# EAGLE design USB_Hub (EAGLE 9.6.2)
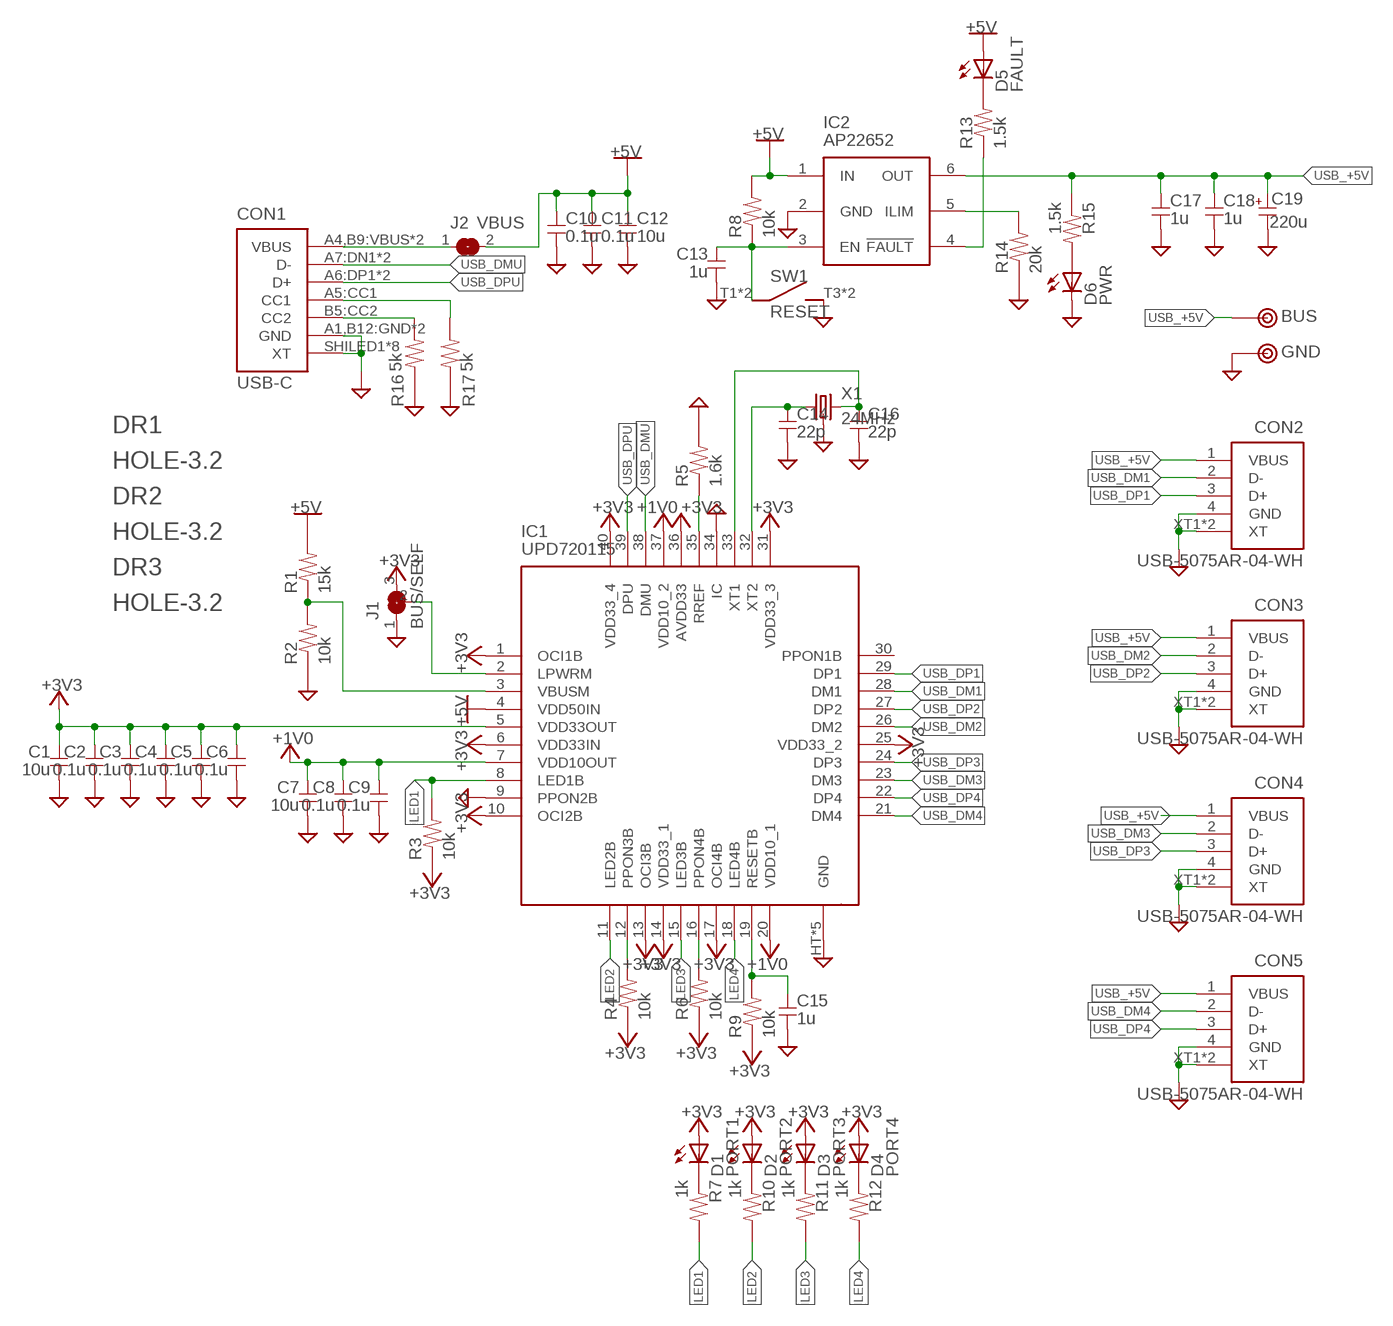
[diagram p0: schematic, sheet 1]

## Parts
C1  10u  C-1608  [1608]
C2  0.1u  C-1608  [1608]
C3  0.1u  C-1608  [1608]
C4  0.1u  C-1608  [1608]
C5  0.1u  C-1608  [1608]
C6  0.1u  C-1608  [1608]
C7  10u  C-1608  [1608]
C8  0.1u  C-1608  [1608]
C9  0.1u  C-1608  [1608]
C10  0.1u  C-1608  [1608]
C11  0.1u  C-1608  [1608]
C12  10u  C-2012  [2012]
C13  1u  C-1608  [1608]
C14  22p  C-1608  [1608]
C15  1u  C-1608  [1608]
C16  22p  C-1608  [1608]
C17  1u  C-1608  [1608]
C18  1u  C-1608  [1608]
C19  220u  CPOLE2.5-6.5  [E2.5-6.5]
CON1  USB-C  [5077CR-16-SMC2-BK-TR]
CON2  USB-5075AR-04-WH  [5075AR-04-WH]
CON3  USB-5075AR-04-WH  [5075AR-04-WH]
CON4  USB-5075AR-04-WH  [5075AR-04-WH]
CON5  USB-5075AR-04-WH  [5075AR-04-WH]
D1  PORT1  LED-2.5  [LED2.5]
D2  PORT2  LED-2.5  [LED2.5]
D3  PORT3  LED-2.5  [LED2.5]
D4  PORT4  LED-2.5  [LED2.5]
D5  FAULT  LED-SMD1608  [D1608]
D6  PWR  LED-SMD1608  [D1608]
DR1  HOLE-3.2  [HOLE_3.2]
DR2  HOLE-3.2  [HOLE_3.2]
DR3  HOLE-3.2  [HOLE_3.2]
IC1  UPD720115  [QFN40HT]
IC2  AP22652  [SOT23-6]
J1  BUS/SELF  SJ-3-1608  [1608-3-J]
J2  VBUS  SJ-1608  [1608-J]
R1  15k  R-1608  [1608]
R2  10k  R-1608  [1608]
R3  10k  R-1608  [1608]
R4  10k  R-1608  [1608]
R5  1.6k  R-1608  [1608]
R6  10k  R-1608  [1608]
R7  1k  R-1608  [1608]
R8  10k  R-1608  [1608]
R9  10k  R-1608  [1608]
R10  1k  R-1608  [1608]
R11  1k  R-1608  [1608]
R12  1k  R-1608  [1608]
R13  1.5k  R-1608  [1608]
R14  20k  R-1608  [1608]
R15  1.5k  R-1608  [1608]
R16  5k  R-1608  [1608]
R17  5k  R-1608  [1608]
SW1  RESET  SW  [SW_PUSH]
TP1  BUS  TESTPIN  [TESTPIN]
TP2  GND  TESTPIN  [TESTPIN]
X1  24MHz  CRYSTAL2  [KC3225]

## Nets
+1V0 [Power]: C7.1 C8.1 C9.1 IC1.7(VDD10OUT) IC1.20(VDD10_1) IC1.37(VDD10_2)
+3V3 [Power]: C1.1 C2.1 C3.1 C4.1 C5.1 C6.1 D1.A D2.A D3.A D4.A IC1.1(OCI1B) IC1.5(VDD33OUT) IC1.6(VDD33IN) IC1.10(OCI2B) IC1.13(OCI3B) IC1.14(VDD33_1) IC1.17(OCI4B) IC1.25(VDD33_2) IC1.31(VDD33_3) IC1.36(AVDD33) IC1.40(VDD33_4) J1.3 R3.1 R4.1 R6.1 R9.1
+5V: C10.1 C11.1 C12.1 D5.A IC1.4(VDD50IN) IC2.1(IN) J2.2 R1.2 R8.2
GND: C1.2 C2.2 C3.2 C4.2 C5.2 C6.2 C7.2 C8.2 C9.2 C10.2 C11.2 C12.2 C13.2 C14.2 C15.2 C16.2 C17.2 C18.2 C19.- CON1.A1,B12:GND(GND) CON1.B1,A12:GND(GND) CON1.SHILED1(XT) CON1.SHILED2(XT) CON1.SHILED3(XT) CON1.SHILED4(XT) CON1.SHILED5(XT) CON1.SHILED6(XT) CON1.SHILED7(XT) CON1.SHILED8(XT) CON2.4(GND) CON2.XT1(XT) CON2.XT2(XT) CON3.4(GND) CON3.XT1(XT) CON3.XT2(XT) CON4.4(GND) CON4.XT1(XT) CON4.XT2(XT) CON5.4(GND) CON5.XT1(XT) CON5.XT2(XT) D6.K IC1.9(PPON2B) IC1.34(IC) IC1.HT1(GND) IC1.HT2(GND) IC1.HT3(GND) IC1.HT4(GND) IC1.HT(GND) IC2.2(GND) J1.1 R2.1 R5.2 R14.1 R16.1 R17.1 SW1.T3 SW1.T4 TP2.1 X1.2(GND) X1.4(GND)
LED1: IC1.8(LED1B) R3.2 R7.2
LED2: IC1.11(LED2B) R10.2
LED3: IC1.15(LED3B) R11.2
LED4: IC1.18(LED4B) R12.2
N$1: CON1.A4,B9:VBUS(VBUS) CON1.B4,A9:VBUS(VBUS) J2.1
N$2: D5.K R13.2
N$3: IC1.3(VBUSM) R1.1 R2.2
N$4: IC1.35(RREF) R5.1
N$5: C14.1 IC1.32(XT2) X1.1
N$6: C16.1 IC1.33(XT1) X1.3
N$7: C15.1 IC1.19(RESETB) R9.2
N$8: D1.K R7.1
N$9: D2.K R10.1
N$10: D3.K R11.1
N$11: D4.K R12.1
N$12: IC2.4(!FAULT) R13.1
N$13: IC2.5(ILIM) R14.2
N$14: IC1.16(PPON4B) R6.2
N$15: IC1.12(PPON3B) R4.2
N$16: D6.A R15.2
N$17: IC1.2(LPWRM) J1.2
N$18: CON1.B5:CC2(CC2) R16.2
N$19: CON1.A5:CC1(CC1) R17.2
USB_+5V: C17.1 C18.1 C19.+ CON2.1(VBUS) CON3.1(VBUS) CON4.1(VBUS) CON5.1(VBUS) IC2.6(OUT) R15.1 TP1.1
USB_DM1: CON2.2(D-) IC1.28(DM1)
USB_DM2: CON3.2(D-) IC1.26(DM2)
USB_DM3: CON4.2(D-) IC1.23(DM3)
USB_DM4: CON5.2(D-) IC1.21(DM4)
USB_DMU: CON1.A7:DN1(D-) CON1.B7:DN2(D-) IC1.38(DMU)
USB_DP1: CON2.3(D+) IC1.29(DP1)
USB_DP2: CON3.3(D+) IC1.27(DP2)
USB_DP3: CON4.3(D+) IC1.24(DP3)
USB_DP4: CON5.3(D+) IC1.22(DP4)
USB_DPU: CON1.A6:DP1(D+) CON1.B6:DP2(D+) IC1.39(DPU)
VBUS_EN: C13.1 IC2.3(EN) R8.1 SW1.T1 SW1.T2
Unconnected: IC1.30(PPON1B)

## Library data of the parts
C1-C18 = my_rcl:C
C19 = my_rcl:CPOL
CON1 = my_connector:USB-C
CON2-CON5 = my_connector:USB
D1-D6 = my_rcl:LED
DR1-DR3 = my_connector:HOLE-3.2
IC1 = my_ic:UPD720115
IC2 = my_ic:AP22652
J1 = my_rcl:SJ-3
J2 = my_rcl:SJ
R1-R17 = my_rcl:R
SW1 = my_rcl:SW
TP1 TP2 = my_connector:TESTPIN
X1 = my_rcl:CRYSTAL2: CRYSTAL

## Net classes
1 Power: width 0.254 mm

## Board
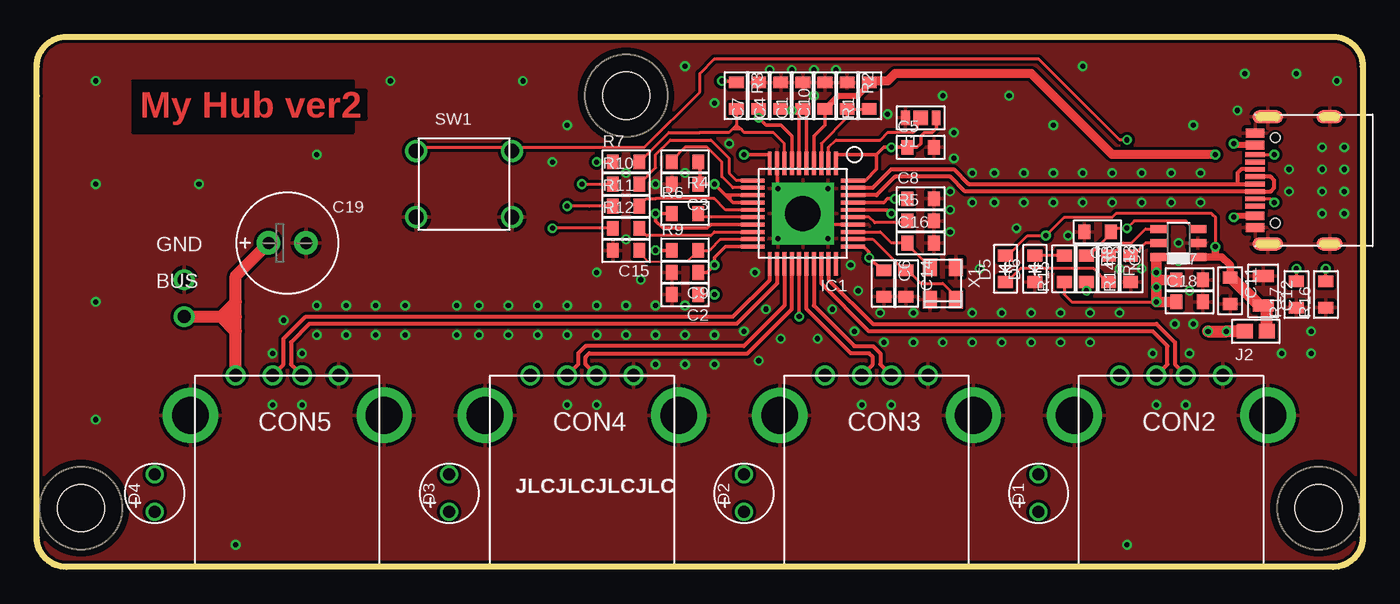
[diagram p1: board, top side]
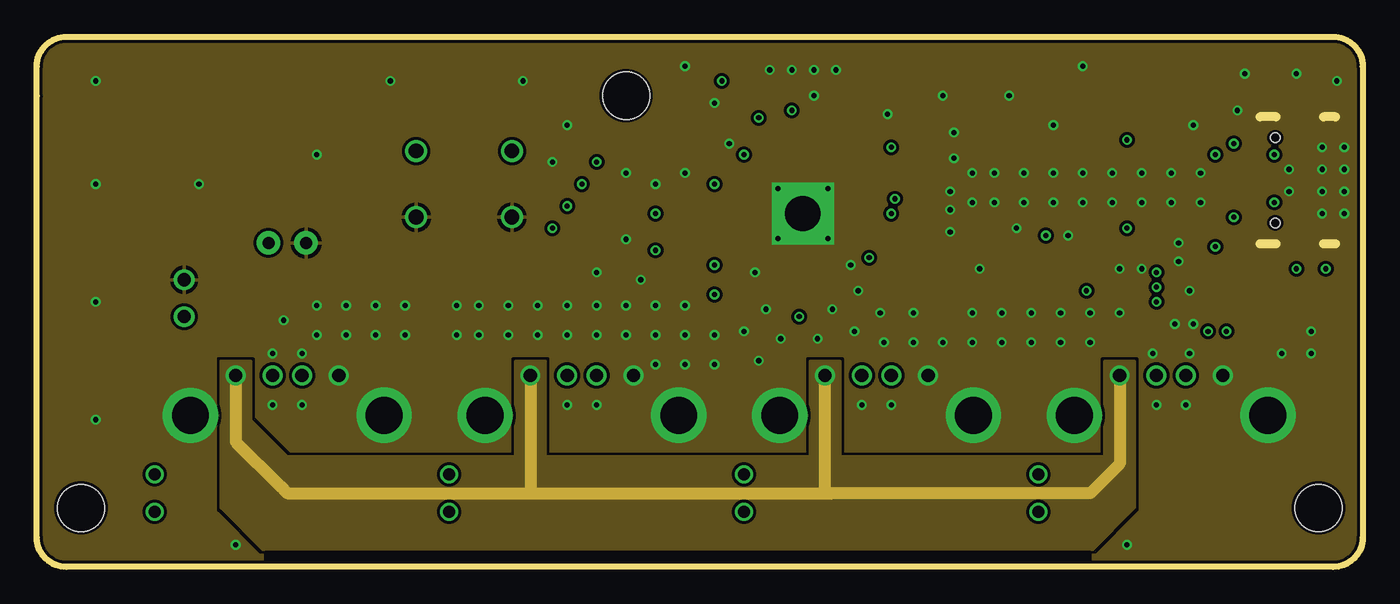
[diagram p2: board, inner layer Route2]
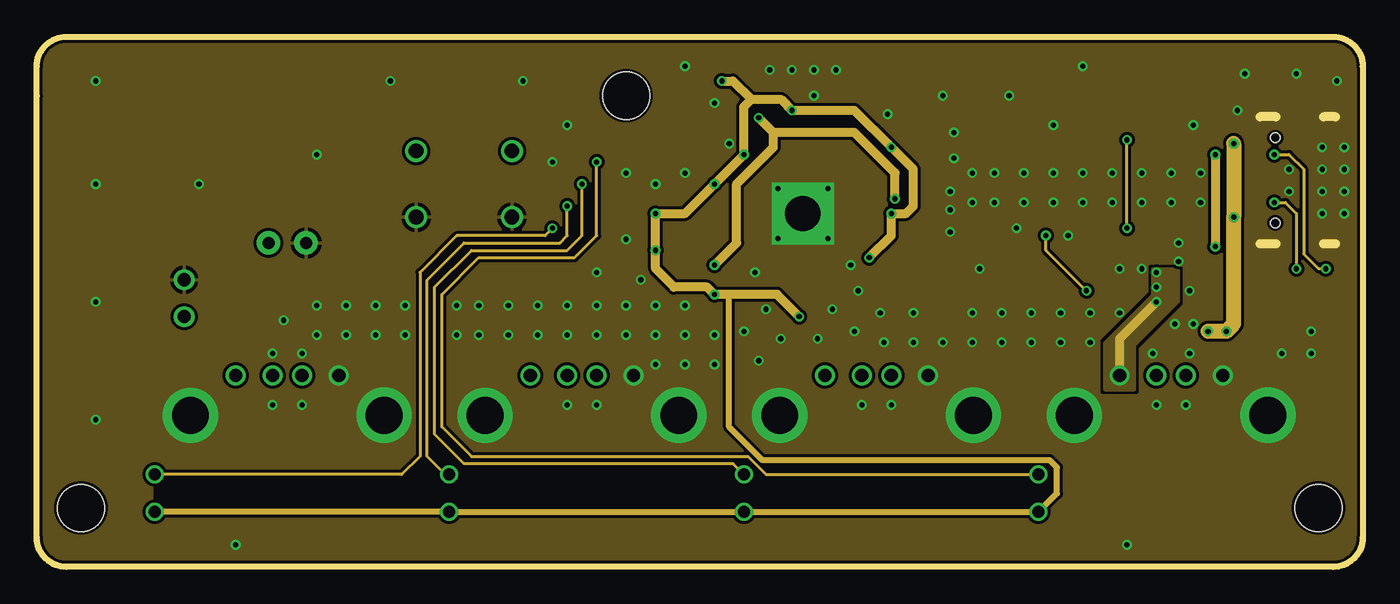
[diagram p3: board, inner layer Route15]
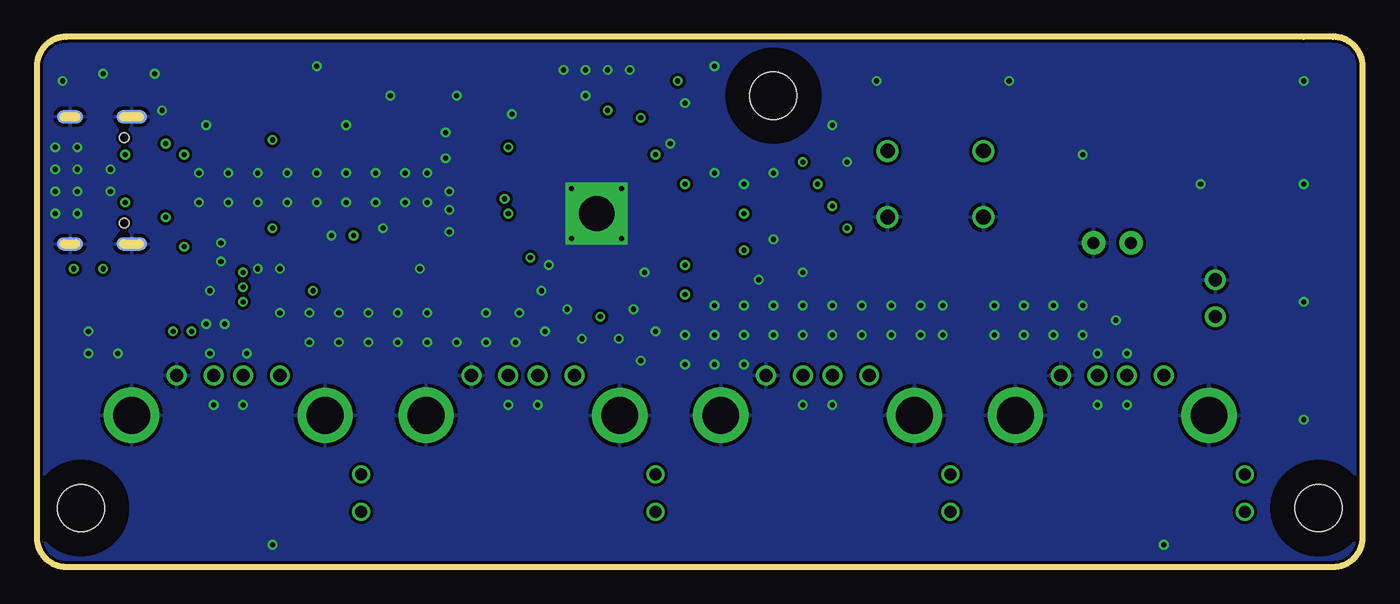
[diagram p4: board, bottom side, seen from below]

Size 90 x 36 mm. Coordinates in mm from the lower left corner, seen from the top.
Outline: 0,2 0,32 0,34 arc-90 2,36 4,36 88,36 arc-90 90,34 90,2 arc-90 88,0 2,0 arc-90 0,2
Copper layers (1*2*15*16): Top 0.035mm / dielectric 0.2mm / Route2 0.0175mm / dielectric 1.065mm / Route15 0.0175mm / dielectric 0.2mm / Bottom 0.035mm
Design rules "JLCPCB_4layer *": minimum track width 6mil, minimum drill 0.3mm, track to track 6mil, track to pad 6mil, pad to pad 6mil, via to via 8mil, smd to smd 0mil, copper to edge 0.2mm, drill to drill 0.4mm, minimum pad ring 8mil, minimum via ring 6mil, stop-mask expansion 4mil, vias tented up to drill 1mm, thermal gap 10mil
bRestrict: 2 lines

### Footprints (pad centres in the part's own frame; a part is rotated, then mirrored left to right if it is on the bottom)
1608 = smd 0.8 x 1: 1 -0.9,0; 2 0.9,0
2012 = smd 0.8 x 1.4: 1 -1,0; 2 1,0
E2.5-6.5 = drill 0.813 pad 1.6: + -1.27,0; - 1.27,0
5077CR-16-SMC2-BK-TR = smd 0.6 x 1.34: A1,B12:GND -3.2,0.3; A4,B9:VBUS -2.4,0.3; B1,A12:GND 3.2,0.3; B4,A9:VBUS 2.4,0.3 | smd 0.3 x 1.34: A5:CC1 -1.25,0.3; A6:DP1 -0.25,0.3; A7:DN1 0.25,0.3; A8:SBU1 1.25,0.3; B5:CC2 1.75,0.3; B6:DP2 0.75,0.3; B7:DN2 -0.75,0.3; B8:SBU2 -1.75,0.3 | smd 0.9 x 2.1: SHILED1 -4.32,-0.57; SHILED2 4.32,-0.57 | smd 0.9 x 1.8: SHILED3 -4.32,-4.75; SHILED4 4.32,-4.75 | smd 0.9 x 2.1 bottom: SHILED5 -4.32,-0.57; SHILED7 4.32,-0.57 | smd 0.9 x 1.8 bottom: SHILED6 -4.32,-4.75; SHILED8 4.32,-4.75 | hole 0.65: -2.89,-1.07; 2.89,-1.07
5075AR-04-WH = drill 0.9: 1 3.5,0; 2 1,0; 3 -1,0; 4 -3.5,0 | drill 2.5: XT1 -6.57,2.7; XT2 6.57,2.71
LED2.5 = drill 0.813: A -1.27,0; K 1.27,0
D1608 = smd 0.8 x 1: A 0.9,0; K -0.9,0
HOLE_3.2 = hole 3.2: 0,0
QFN40HT = smd 0.27 x 1.6: 1 -2.25,-3.4; 2 -1.75,-3.4; 3 -1.25,-3.4; 4 -0.75,-3.4; 5 -0.25,-3.4; 6 0.25,-3.4; 7 0.75,-3.4; 8 1.25,-3.4; 9 1.75,-3.4; 10 2.25,-3.4; 21 2.25,3.4; 22 1.75,3.4; 23 1.25,3.4; 24 0.75,3.4; 25 0.25,3.4; 26 -0.25,3.4; 27 -0.75,3.4; 28 -1.25,3.4; 29 -1.75,3.4; 30 -2.25,3.4 | smd 1.6 x 0.27: 11 3.4,-2.25; 12 3.4,-1.75; 13 3.4,-1.25; 14 3.4,-0.75; 15 3.4,-0.25; 16 3.4,0.25; 17 3.4,0.75; 18 3.4,1.25; 19 3.4,1.75; 20 3.4,2.25; 31 -3.4,2.25; 32 -3.4,1.75; 33 -3.4,1.25; 34 -3.4,0.75; 35 -3.4,0.25; 36 -3.4,-0.25; 37 -3.4,-0.75; 38 -3.4,-1.25; 39 -3.4,-1.75; 40 -3.4,-2.25 | drill 2.4 pad 4.2 square: HT 0,0 | drill 0.35 pad 0.8 square: HT1 -1.7,1.7; HT2 -1.7,-1.7; HT3 1.7,-1.7; HT4 1.7,1.7
SOT23-6 = smd 0.55 x 1.2: 1 -0.95,-1.3; 2 0,-1.3; 3 0.95,-1.3; 4 0.95,1.3; 5 0,1.3; 6 -0.95,1.3
1608-3-J = smd 0.6 x 1: 1 -1.05,0; 3 1.05,0 | smd 1 x 1: 2 0,0
1608-J = smd 1.1 x 1: 1 -0.75,0; 2 0.75,0
SW_PUSH = drill 1: T1 -3.25,2.25; T2 3.25,2.25; T3 -3.25,-2.25; T4 3.25,-2.25
TESTPIN = drill 0.9 pad 1.4: 1 0,0
KC3225 = smd 1.2 x 0.95: 1 -1.1,-0.875; 2 1.1,-0.875; 3 1.1,0.875; 4 -1.1,0.875

### Placement (x,y rotation side)
C1  52,32 90 top
C2  44,18.5 180 top
C3  44,26 180 top
C4  50.5,32 90 top
C5  60,28.5 0 top
C6  57.5,19.25 270 top
C7  49,32 90 top
C8  60,25 0 top
C9  44,20 180 top
C10  53.5,32 90 top
C11  81,18.75 270 top
C12  83.25,18.75 90 top
C13  72,22.75 180 top
C14  59,19.25 270 top
C15  40,21.5 180 top
C16  60,22 0 top
C17  78.25,19.5 0 top
C18  78.25,18 0 top
C19  17,22 0 top
CON1  83,26.25 90 top
CON2  77,13 180 top
CON3  57,13 180 top
CON4  37,13 180 top
CON5  17,13 180 top
D1  68,5 90 top
D2  48,5 90 top
D3  28,5 90 top
D4  8,5 90 top
D5  65.75,20.25 90 top
D6  67.75,20.25 90 top
DR1  3,4 0 top
DR2  87,4 0 top
DR3  40,32 0 top
IC1  52,24 180 top
IC2  77.5,22 90 top
J1  60,30.5 0 top
J2  82.75,16 0 top
R1  56.5,32 90 top
R2  55,32 270 top
R3  47.5,32 270 top
R4  44,27.5 180 top
R5  60,23.5 0 top
R6  44,24 0 top
R7  40,27.5 0 top
R8  71.25,20.25 270 top
R9  44,21.5 0 top
R10  40,26 0 top
R11  40,24.5 0 top
R12  40,23 0 top
R13  72.75,20.25 270 top
R14  74.25,20.25 90 top
R15  69.75,20.25 90 top
R16  87.5,18.5 90 top
R17  85.5,18.5 90 top
SW1  29,26 0 top
TP1  10,17 0 top
TP2  10,19.5 0 top
X1  61.5,19.25 90 top

### Tracks (layer width: path | path; a pad name or v marks a point on that pad's centre or on a via)
+1V0  (via drill 0.35)
  Top 0.254: IC1.20 46.75,21.75 46,21 v46,20.5 45.5,20 C9.1 | IC1.7 51.25,29.25 50.5,30 49.5,30 v49,30.5 C7.1 | IC1.37 57.5,24.75 57.75,25 v58.25,25 C8.1
  Route15 0.61: v58.25,25 58.25,26.75 55.5,29.5 50,29.5 | 50,29.5 v49,30.5 | v46,20.5 47.5,22 47.5,26 50,28.5 50,29.5
+3V3  (via drill 0.35)
  Top 0.254: IC1.25 v51.75,17 | C2.1 v46,18.5 | IC1.17 45.75,23.25 45.5,23 42.5,23 42,23.5 v42,24 R6.1 | R4.1 45,27.4 45,26.1 | 45,26.1 C3.1 | 45,26.1 45.1,26 v46,26 46.75,25.25 | IC1.13 47.25,25.25 47,25.25 | 47,25.25 46.88,25.25 46.75,25.25 | 46.75,25.25 47.06,24.94 | 47.06,24.94 47.25,24.75 IC1.14 | 47,25.25 47.06,25.19 47.06,24.94 | v48,28 49.75,28 IC1.10 | R3.1 47.4,33 v46.5,33 | C4.1 50.6,31 v51.25,31 51.9,31 C1.1 | IC1.6 51.75,30.85 C1.1 | IC1.5 52.25,30.85 C1.1 | 57,28 57.5,28.5 v58,28.5 C5.1 59.75,28.5 60,28.75 60,29.25 60.25,29.5 60.75,29.5 61.05,29.8 J1.3 | IC1.40 56.25,26.25 57,27 57,28 | IC1.1 54.25,28 57,28 | IC1.36 57.75,24.25 v58,24 | C6.1 57.35,20.15 v56.5,21 56.5,21.38 56.12,21.75 IC1.31 | R9.1 v42,21.5
  Route15 0.406: 47,18.5 47,9.5 49.25,7.25 68.75,7.25 69.25,6.75 69.25,4.98 D1.A D2.A D3.A D4.A
  Route15 0.61: v46,18.5 45.5,19 43.25,19 42,20.25 v42,21.5 v42,24 44,24 v46,26 v48,28 48,31.25 48.5,31.75 | v56.5,21 58,22.5 v58,24 59,24 59.5,24.5 59.5,27 v58,28.5 55.5,31 v51.25,31 50.5,31.75 48.5,31.75 | v51.75,17 50.25,18.5 v46,18.5 | v46.5,33 47.25,33 48.5,31.75 | 47,18.5 v46,18.5
+5V  (via drill 0.35)
  Top 0.203: D5.A 65.9,21.15 67.25,22.5 v68.5,22.5 69.75,23.75 73,23.75 73.25,24 79.75,24 79.88,23.88 80,23.75 v80,21.75 | R8.2 v71.25,18.75
  Top 0.254: IC1.4 52.75,29.25 53.5,30 C10.1
  Top 0.406: C10.1 54.4,32 55.75,32 56.5,32.75 R1.2
  Top 0.508: C11.1 81,20.5 80.45,21.05 80,21.05 | IC2.1 80,21.05 | 80,21.05 v80,21.75
  Top 0.61: v80,28 73,28 67.5,33.5 58.25,33.5 57.75,33 56.85,33 56.75,32.9 R1.2
  Top 0.813: C11.1 81.1,19.65 83,17.75 C12.1 83.5,17.5 J2.2
  Route15 0.203: v71.25,18.75 68.5,21.5 v68.5,22.5
  Route15 0.61: v80,28 v80,21.75
GND  (via drill 0.35)
  Top 0.203: IC1.34 52.75,23.25 IC1.HT 50.25,25.75 IC1.9
  other vias: 42,26 70,22.5 54,17.5 55.5,16 49.5,17.5 48,16 57.5,15.25 59.5,15.25 61.5,15.25 63.5,15.25 65.5,15.25 67.5,15.25 69.5,15.25 71.5,15.25 75.75,14.5 57.25,17.25 63.5,17.25 65.5,17.25 67.5,17.25 69.5,17.25 71.5,17.25 77.25,16.5 55.75,18.75 55.25,20.5 48.75,20 46,15.75 44,15.75 42,15.75 40,15.75 38,15.75 36,15.75 34,15.75 32,15.75 30,15.75 28.5,15.75 28.5,17.75 30,17.75 32,17.75 34,17.75 36,17.75 38,17.75 40,17.75 42,17.75 44,17.75 25,15.75 25,17.75 23,17.75 23,15.75 21,15.75 19,15.75 19,17.75 21,17.75 16.75,16.75 16,14.5 42,13.75 44,13.75 46,13.75 50.5,15.5 53,15.5 78.25,14.5 77,26.75 77,24.75 75,26.75 73,26.75 71,26.75 65,26.75 63.5,26.75 65,24.75 67,24.75 69,24.75 71,24.75 62.25,27.75 62,25.5 75,24.75 73,24.75 63.5,24.75 62,22.75 62,24.25 77.5,20.75 77.5,22 78.5,16.5 84.5,14.5 85.5,33.5 88.25,33 87.25,28.5 87.25,27 87.25,25.5 88.75,25.5 88.75,27 88.75,28.5 61.5,32 62.25,29.5 54.25,33.75 52.75,33.75 51.25,33.75 49.75,33.75 52.75,32 46,31.5 57.75,30.75 41,19.5 44,26.75 44,34 16,11 18,11 36,11 38,11 56,11 58,11 76,11 78,11 13.5,1.5 74,1.5 19,28 11,26 35,27.5 67,26.75 36,30 66.5,23 73.5,20.25 75,20.25 64,20.25 59.5,17.25 79,26.75 79,24.75 69,26.75 69,30 66,32 71,34 78.5,30 82,33.5 4,26 4,10 4,18 86.5,14.5 78.25,18.75 85,27 85,25.5 87.25,24 88.75,24 81.5,31 86.5,16 40,26.75 40,22.25 38,20 24,33 4,33 33,33 47,28.75 49,14 73.5,17.25 18,14.5
  pour Route2 (isolate 0.203, rank 4): 0,0 0,36 90,36 90,0
  pour Route15 (isolate 0.203, rank 4): 0,0 0,36 90,36 90,0
  pour Top (isolate 0.203): 0,36 90,36 90,0 0,0
  pour Bottom (isolate 0.203): 0,36 90,36 90,0 0,0
  pour Bottom (isolate 0.203, no thermals): 49,27 55,27 55,21 49,21
  pour Route2 (isolate 0.203, no thermals): 49,27 55,27 55,21 49,21
  pour Route15 (isolate 0.203, no thermals): 49,27 55,27 55,21 49,21
  cutout Route2 (isolate 0.203, rank 3, no thermals): 15.5,1 15.5,0 71.5,0 71.5,1
  cutout Top (isolate 0.203, no thermals): 6.5,33 6.5,29.5 21.5,29.5 21.5,33
  pour Route15 (isolate 0.203, rank 4, no thermals): 7.5,7.5 7.5,14.5 86.5,14.5 86.5,7.5
  pour Route2 (isolate 0.203, rank 4, no thermals): 7.5,7.5 86.5,7.5 86.5,14.5 7.5,14.5
  cutout Route15: 8,6 8,4 9,4 9,6
LED1
  Top 0.203: IC1.8 50.75,28.75 50,29.5 48,29.5 47.75,29.75 | 47.75,29.75 47.5,30 | R3.2 47.5,30 | R7.2 42.9,29.5 45,29.5 47,29.5 47.25,29.75 | 47.5,30 47.38,29.88 47.25,29.75 | 47.25,29.75 47.75,29.75
LED2
  Top 0.203: IC1.11 47.5,26.25 47,26.75 47,27.75 45.75,29 43,29 42,28 42,27.1 R10.2
LED3
  Top 0.203: IC1.15 46.75,24.25 46,25 42,25 41.4,25 R11.2
LED4
  Top 0.203: IC1.18 46,22.75 45.75,22.5 41.4,22.5 R12.2
N$1  (via drill 0.35)
  Top 0.406: CON1.B4,A9:VBUS 81.35,28.65 v81.25,28.75 | CON1.A4,B9:VBUS 81.35,23.85 v81.25,23.75
  Top 0.813: J2.1 v80.75,16 v79.5,16
  Route15 1.016: v81.25,28.75 v81.25,23.75 81.25,16.5 v80.75,16 v79.5,16
N$2
  Top 0.152: 65.85,19.35 D5.K
  Top 0.203: R13.2 72.65,19.35 71.75,20.25 66.75,20.25 65.85,19.35
N$3
  Top 0.203: IC1.3 53.25,28.75 55,30.5 R2.2 R1.1
N$4
  Top 0.203: IC1.35 56.5,23.75 56.88,23.38 58.98,23.38 R5.1
N$5
  Top 0.203: IC1.32 56.75,22.25 58.85,20.15 C14.1 59.1,20.15 60,19.25 61.5,19.25 62.38,18.38 X1.1
N$6
  Top 0.203: IC1.33 57.25,22.75 57.75,22.25 | 57.75,22.25 58,22 | X1.3 60.62,20.38 59,22 C16.1 58,22 | 58,22 57.75,22.25
N$7
  Top 0.152: R9.2 44.15,20.75 41.5,20.75 40.9,21.35 C15.1
  Top 0.203: R9.2 45.65,21.5 46.4,22.25 IC1.19
N$8  (via drill 0.35)
  Top 0.203: R7.1 v38,27.5
  Route15 0.203: v38,27.5 38,22.5 36.5,21 30,21 27.5,18.5 27.5,9.5 29.5,7.5 48.27,7.5 49.5,6.27 D1.K
N$9  (via drill 0.35)
  Top 0.203: v37,26 R10.1
  Route15 0.203: v37,26 37,22.5 36,21.5 29.5,21.5 27,19 27,12 27,9 29,7 47.27,7 D2.K
N$10  (via drill 0.35)
  Top 0.203: R11.1 37.5,24.5 v36,24.5
  Route15 0.203: v36,24.5 36,22.5 35.5,22 29,22 26.5,19.5 26.5,7.5 27.73,6.27 D3.K
N$11  (via drill 0.35)
  Top 0.203: R12.1 v35,23
  Route15 0.203: v35,23 34.5,22.5 28.5,22.5 26,20 26,7.5 24.77,6.27 D4.K
N$12
  Top 0.203: IC2.4 75.25,22.95 74.3,22 73.75,22 72.9,21.15 R13.1
N$13
  Top 0.203: IC2.5 75.25,22 74.4,21.15 R14.2
N$14
  Top 0.203: R6.2 45.15,23.75 IC1.16
N$15
  Top 0.203: IC1.12 47.25,25.75 46.5,26.5 46.5,27.5 45.5,28.5 44,28.5 43.1,27.6 R4.2
N$16
  Top 0.203: R15.2 D6.A
N$17
  Top 0.203: IC1.2 53.75,28.5 54.25,29 57.25,29 57.75,29.5 59.5,29.5 59.75,29.75 59.75,30.25 J1.2
N$18  (via drill 0.35)
  Top 0.203: CON1.B5:CC2 v84,28 | R16.2 v87.5,20.25
  Route15 0.203: v84,28 85,28 86,27 86,21.25 87,20.25 v87.5,20.25
N$19  (via drill 0.35)
  Top 0.203: CON1.A5:CC1 83.75,25 v84,24.75 | v85.5,20.25 R17.2
  Route15 0.203: v84,24.75 84.75,24.75 85.5,24 v85.5,20.25
USB_+5V  (via drill 0.35)
  Top 0.203: R15.1 69.75,18.5 70.25,18 v76,18
  Top 0.406: IC2.6 76,20.85
  Top 0.711: 76,20.85 v76,20 76,19.5 | 76,19.5 v76,19 v76,18 C18.1 | C17.1 76,19.5
  Top 0.813: C19.+ 13.5,19.77 13.5,18 | CON5.1 13.5,16 | 13.5,16 13.5,17 | 13.5,17 13.5,18 | TP1.1 12.5,17 | 12.5,17 13,17 13.5,17 | 13.5,16 12.5,17 | 12.5,17 13.5,18
  Route2 0.813: 33.5,5 54,5 | CON4.1 33.5,5 | CON5.1 13.5,8.5 16.5,5.5 17,5 33.5,5 | CON2.1 73.5,7 71.5,5 54,5 | 54,5 53.5,5 CON3.1
  Route15 0.61: v76,18 73.5,15.5 CON2.1
  pour Route2 (isolate 0.203, no thermals): 72.5,14 74.5,14 74.5,4 71.5,1 15.5,1 12.5,4 12.5,14 14.5,14 14.5,10 17,7.5 32.5,7.5 32.5,14 34.5,14 34.5,7.5 52.5,7.5 52.5,14 54.5,14 54.5,7.5 72.5,7.5
  pour Route15 (isolate 0.203, no thermals): 74.5,12 72.5,12 72.5,15.25 75.75,18.5 75.75,20.25 77.5,20.25 77.5,18 74.5,15
USB_DM1
  Top 0.27: CON2.2 76.75,13.75 76.75,15 75.75,16 56.5,16 53.25,19.25 IC1.28
USB_DM2
  Top 0.27: CON3.2 56.75,13.75 56.75,14.25 56.5,14.5 55.25,14.5 52.25,17.5 IC1.26
USB_DM3
  Top 0.27: IC1.23 50.75,17.75 48,15 37.25,15 36.75,14.5 36.75,13.75 CON4.2
USB_DM4
  Top 0.27: CON5.2 16.75,13.75 16.75,15.5 18.25,17 47.25,17 49.75,19.5 IC1.21
USB_DMU
  Top 0.27: IC1.38 57,25.25 58.25,26.5 62,26.5 63,25.5 CON1.B7:DN2 83.75,25.5 84,25.75 84,26.25 83.75,26.5 CON1.A7:DN1
USB_DP1
  Top 0.27: IC1.29 53.75,19.5 56.75,16.5 76,16.5 77.25,15.25 77.25,13.75 CON2.3
USB_DP2
  Top 0.27: IC1.27 52.75,17.75 55.5,15 56.75,15 57.25,14.5 57.25,13.75 CON3.3
USB_DP3
  Top 0.27: CON4.3 37.25,13.75 37.25,14.25 37.5,14.5 48.25,14.5 51.25,17.5 IC1.24
USB_DP4
  Top 0.27: IC1.22 50.25,19.25 47.5,16.5 18.5,16.5 17.25,15.25 17.25,13.75 CON5.3
USB_DPU
  Top 0.27: IC1.39 56.75,25.75 58,27 62.25,27 63.25,26 81.5,26 | 81.5,26 CON1.A6:DP1 | CON1.B6:DP2 81.75,27 81.5,26.75 81.5,26
VBUS_EN  (via drill 0.35)
  Top 0.203: IC2.3 78.55,22.95 78,23.5 74.75,23.5 74.5,23.5 v74,23 73.15,23 C13.1 72.9,22.65 71.4,21.15 R8.1 | v74,29 73.5,29 68,34.5 46,34.5 45,33.5 45,32.25 41.25,28.5 32.5,28.5 SW1.T2 32,28.5 26,28.5 SW1.T1
  Route15 0.203: v74,23 v74,29

### Text on the board
Top: My Hub ver2
tPlace: JLCJLCJLCJLC